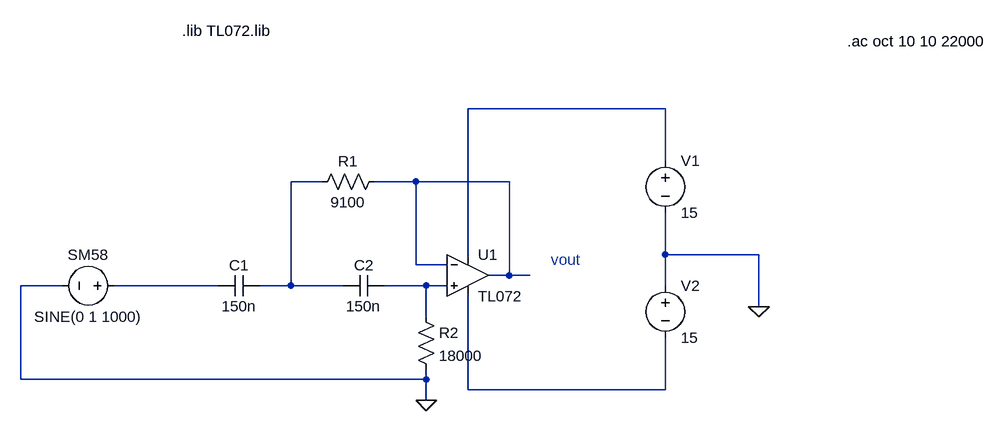
[diagram p0: schematic 80Hz High Pass.asc]
80Hz High Pass.asc, the LTspice schematic file:
Version 4
SHEET 1 1100 720
WIRE 576 128 272 128
WIRE 576 208 576 128
WIRE 48 240 0 240
WIRE 192 240 128 240
WIRE 336 240 192 240
WIRE 272 352 272 128
WIRE 576 352 576 288
WIRE 720 352 576 352
WIRE 192 368 192 240
WIRE 240 368 192 368
WIRE 336 384 336 240
WIRE 336 384 304 384
WIRE 368 384 336 384
WIRE -352 400 -416 400
WIRE -112 400 -272 400
WIRE 0 400 0 240
WIRE 0 400 -48 400
WIRE 80 400 0 400
WIRE 208 400 144 400
WIRE 240 400 208 400
WIRE 576 400 576 352
WIRE 720 432 720 352
WIRE 208 448 208 400
WIRE -416 544 -416 400
WIRE 208 544 208 528
WIRE 208 544 -416 544
WIRE 272 560 272 416
WIRE 576 560 576 480
WIRE 576 560 272 560
WIRE 208 576 208 544
FLAG 720 432 0
FLAG 208 576 0
SYMBOL Cap -48 384 R90
WINDOW 0 0 32 VBottom 2
WINDOW 3 32 32 VTop 2
SYMATTR InstName C1
SYMATTR Value 150n
SYMBOL Cap 144 384 R90
WINDOW 0 0 32 VBottom 2
WINDOW 3 32 32 VTop 2
SYMATTR InstName C2
SYMATTR Value 150n
SYMBOL Res 144 224 R90
WINDOW 0 0 56 VBottom 2
WINDOW 3 32 56 VTop 2
SYMATTR InstName R1
SYMATTR Value 9100
SYMBOL OpAmps/opamp2 272 320 R0
SYMATTR InstName U1
SYMATTR Value TL072
SYMBOL Voltage 576 192 R0
SYMATTR InstName V1
SYMATTR Value 15
SYMBOL Voltage 576 384 R0
SYMATTR InstName V2
SYMATTR Value 15
SYMBOL Res 192 432 R0
SYMATTR InstName R2
SYMATTR Value 18000
SYMBOL Voltage -256 400 R90
WINDOW 0 -32 56 VBottom 2
WINDOW 3 32 56 VTop 2
SYMATTR InstName SM58
SYMATTR Value SINE(0 1 1000)
SYMATTR Value2 AC 1
SYMATTR SpiceLine Rser=180
TEXT 856 24 Left 2 !.ac oct 10 10 22000
TEXT -168 8 Left 2 !.lib TL072.lib
TEXT 400 360 Left 2 ;vout

The netlist it stands for:
* 80Hz High Pass.asc
C1 N002 N004 150n
C2 N005 N002 150n
R1 N003 N002 9100
XU1 N005 N003 N001 N006 N003 TL072  ; pins In+ In- V+ V- OUT
V1 N001 0 15
V2 0 N006 15
R2 N005 0 18000
V§SM58 N004 0 SINE(0 1 1000) AC 1 Rser=180
.ac oct 10 10 22000
.lib TL072.lib
* vout
.backanno
.end